# EasyEDA schematic SIMUL.json
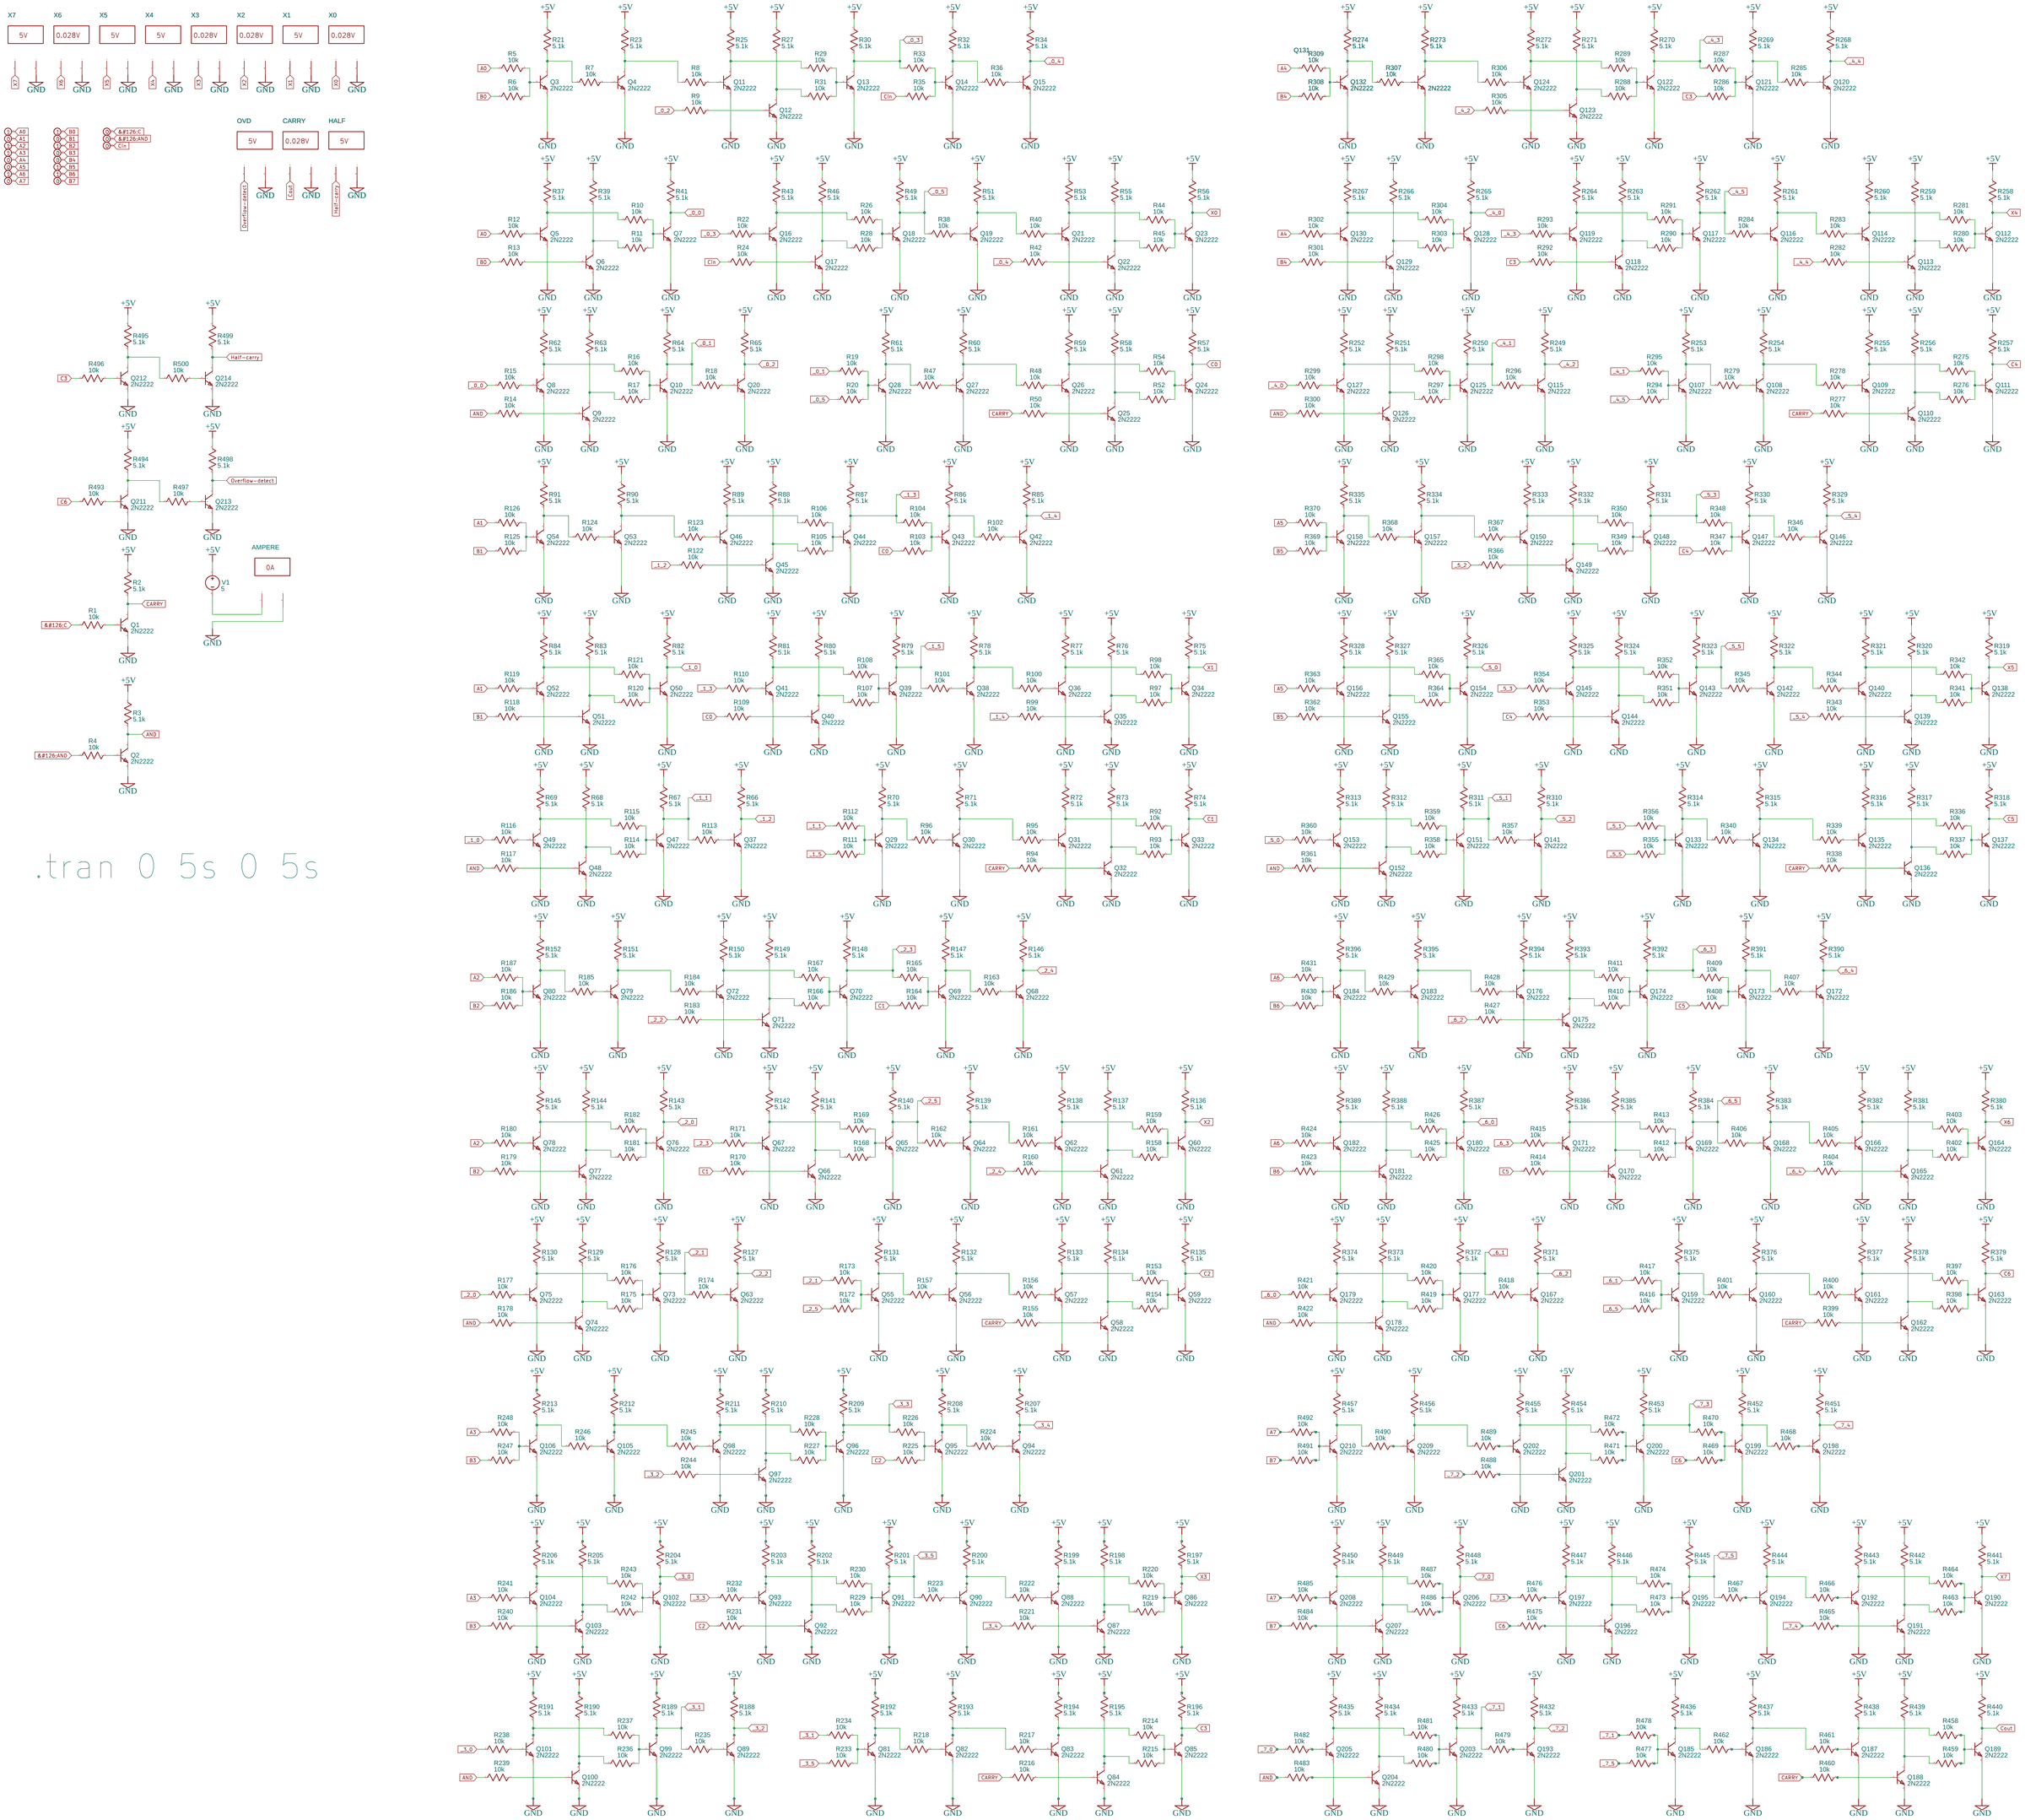
[diagram p0: schematic sheet]

## Parts
AMPERE  Multimeter
CARRY  Multimeter
HALF  Multimeter
OVD  Multimeter
Q1  2N2222
Q2  2N2222
Q3  2N2222
Q4  2N2222
Q5  2N2222
Q6  2N2222
Q7  2N2222
Q8  2N2222
Q9  2N2222
Q10  2N2222
Q11  2N2222
Q12  2N2222
Q13  2N2222
Q14  2N2222
Q15  2N2222
Q16  2N2222
Q17  2N2222
Q18  2N2222
Q19  2N2222
Q20  2N2222
Q21  2N2222
Q22  2N2222
Q23  2N2222
Q24  2N2222
Q25  2N2222
Q26  2N2222
Q27  2N2222
Q28  2N2222
Q29  2N2222
Q30  2N2222
Q31  2N2222
Q32  2N2222
Q33  2N2222
Q34  2N2222
Q35  2N2222
Q36  2N2222
Q37  2N2222
Q38  2N2222
Q39  2N2222
Q40  2N2222
Q41  2N2222
Q42  2N2222
Q43  2N2222
Q44  2N2222
Q45  2N2222
Q46  2N2222
Q47  2N2222
Q48  2N2222
Q49  2N2222
Q50  2N2222
Q51  2N2222
Q52  2N2222
Q53  2N2222
Q54  2N2222
Q55  2N2222
Q56  2N2222
Q57  2N2222
Q58  2N2222
Q59  2N2222
Q60  2N2222
Q61  2N2222
Q62  2N2222
Q63  2N2222
Q64  2N2222
Q65  2N2222
Q66  2N2222
Q67  2N2222
Q68  2N2222
Q69  2N2222
Q70  2N2222
Q71  2N2222
Q72  2N2222
Q73  2N2222
Q74  2N2222
Q75  2N2222
Q76  2N2222
Q77  2N2222
Q78  2N2222
Q79  2N2222
Q80  2N2222
Q81  2N2222
Q82  2N2222
Q83  2N2222
Q84  2N2222
Q85  2N2222
Q86  2N2222
Q87  2N2222
Q88  2N2222
Q89  2N2222
Q90  2N2222
Q91  2N2222
Q92  2N2222
Q93  2N2222
Q94  2N2222
Q95  2N2222
Q96  2N2222
Q97  2N2222
Q98  2N2222
Q99  2N2222
Q100  2N2222
Q101  2N2222
Q102  2N2222
Q103  2N2222
Q104  2N2222
Q105  2N2222
Q106  2N2222
Q107  2N2222
Q108  2N2222
Q109  2N2222
Q110  2N2222
Q111  2N2222
Q112  2N2222
Q113  2N2222
Q114  2N2222
Q115  2N2222
Q116  2N2222
Q117  2N2222
Q118  2N2222
Q119  2N2222
Q120  2N2222
Q121  2N2222
Q122  2N2222
Q123  2N2222
Q124  2N2222
Q125  2N2222
Q126  2N2222
Q127  2N2222
Q128  2N2222
Q129  2N2222
Q130  2N2222
Q131  2N2222
Q132  2N2222
Q133  2N2222
Q134  2N2222
Q135  2N2222
Q136  2N2222
Q137  2N2222
Q138  2N2222
Q139  2N2222
Q140  2N2222
Q141  2N2222
Q142  2N2222
Q143  2N2222
Q144  2N2222
Q145  2N2222
Q146  2N2222
Q147  2N2222
Q148  2N2222
Q149  2N2222
Q150  2N2222
Q151  2N2222
Q152  2N2222
Q153  2N2222
Q154  2N2222
Q155  2N2222
Q156  2N2222
Q157  2N2222
Q158  2N2222
Q159  2N2222
Q160  2N2222
Q161  2N2222
Q162  2N2222
Q163  2N2222
Q164  2N2222
Q165  2N2222
Q166  2N2222
Q167  2N2222
Q168  2N2222
Q169  2N2222
Q170  2N2222
Q171  2N2222
Q172  2N2222
Q173  2N2222
Q174  2N2222
Q175  2N2222
Q176  2N2222
Q177  2N2222
Q178  2N2222
Q179  2N2222
Q180  2N2222
Q181  2N2222
Q182  2N2222
Q183  2N2222
Q184  2N2222
Q185  2N2222
Q186  2N2222
Q187  2N2222
Q188  2N2222
Q189  2N2222
Q190  2N2222
Q191  2N2222
Q192  2N2222
Q193  2N2222
Q194  2N2222
Q195  2N2222
Q196  2N2222
Q197  2N2222
Q198  2N2222
Q199  2N2222
Q200  2N2222
Q201  2N2222
Q202  2N2222
Q203  2N2222
Q204  2N2222
Q205  2N2222
Q206  2N2222
Q207  2N2222
Q208  2N2222
Q209  2N2222
Q210  2N2222
Q211  2N2222
Q212  2N2222
Q213  2N2222
Q214  2N2222
R1  10k  [AXIAL-0.3]
R2  5.1k  [AXIAL-0.3]
R3  5.1k  [AXIAL-0.3]
R4  10k  [AXIAL-0.3]
R5  10k  [AXIAL-0.3]
R6  10k  [AXIAL-0.3]
R7  10k  [AXIAL-0.3]
R8  10k  [AXIAL-0.3]
R9  10k  [AXIAL-0.3]
R10  10k  [AXIAL-0.3]
R11  10k  [AXIAL-0.3]
R12  10k  [AXIAL-0.3]
R13  10k  [AXIAL-0.3]
R14  10k  [AXIAL-0.3]
R15  10k  [AXIAL-0.3]
R16  10k  [AXIAL-0.3]
R17  10k  [AXIAL-0.3]
R18  10k  [AXIAL-0.3]
R19  10k  [AXIAL-0.3]
R20  10k  [AXIAL-0.3]
R21  5.1k  [AXIAL-0.3]
R22  10k  [AXIAL-0.3]
R23  5.1k  [AXIAL-0.3]
R24  10k  [AXIAL-0.3]
R25  5.1k  [AXIAL-0.3]
R26  10k  [AXIAL-0.3]
R27  5.1k  [AXIAL-0.3]
R28  10k  [AXIAL-0.3]
R29  10k  [AXIAL-0.3]
R30  5.1k  [AXIAL-0.3]
R31  10k  [AXIAL-0.3]
R32  5.1k  [AXIAL-0.3]
R33  10k  [AXIAL-0.3]
R34  5.1k  [AXIAL-0.3]
R35  10k  [AXIAL-0.3]
R36  10k  [AXIAL-0.3]
R37  5.1k  [AXIAL-0.3]
R38  10k  [AXIAL-0.3]
R39  5.1k  [AXIAL-0.3]
R40  10k  [AXIAL-0.3]
R41  5.1k  [AXIAL-0.3]
R42  10k  [AXIAL-0.3]
R43  5.1k  [AXIAL-0.3]
R44  10k  [AXIAL-0.3]
R45  10k  [AXIAL-0.3]
R46  5.1k  [AXIAL-0.3]
R47  10k  [AXIAL-0.3]
R48  10k  [AXIAL-0.3]
R49  5.1k  [AXIAL-0.3]
R50  10k  [AXIAL-0.3]
R51  5.1k  [AXIAL-0.3]
R52  10k  [AXIAL-0.3]
R53  5.1k  [AXIAL-0.3]
R54  10k  [AXIAL-0.3]
R55  5.1k  [AXIAL-0.3]
R56  5.1k  [AXIAL-0.3]
R57  5.1k  [AXIAL-0.3]
R58  5.1k  [AXIAL-0.3]
R59  5.1k  [AXIAL-0.3]
R60  5.1k  [AXIAL-0.3]
R61  5.1k  [AXIAL-0.3]
R62  5.1k  [AXIAL-0.3]
R63  5.1k  [AXIAL-0.3]
R64  5.1k  [AXIAL-0.3]
R65  5.1k  [AXIAL-0.3]
R66  5.1k  [AXIAL-0.3]
R67  5.1k  [AXIAL-0.3]
R68  5.1k  [AXIAL-0.3]
R69  5.1k  [AXIAL-0.3]
R70  5.1k  [AXIAL-0.3]
R71  5.1k  [AXIAL-0.3]
R72  5.1k  [AXIAL-0.3]
R73  5.1k  [AXIAL-0.3]
R74  5.1k  [AXIAL-0.3]
R75  5.1k  [AXIAL-0.3]
R76  5.1k  [AXIAL-0.3]
R77  5.1k  [AXIAL-0.3]
R78  5.1k  [AXIAL-0.3]
R79  5.1k  [AXIAL-0.3]
R80  5.1k  [AXIAL-0.3]
R81  5.1k  [AXIAL-0.3]
R82  5.1k  [AXIAL-0.3]
R83  5.1k  [AXIAL-0.3]
R84  5.1k  [AXIAL-0.3]
R85  5.1k  [AXIAL-0.3]
R86  5.1k  [AXIAL-0.3]
R87  5.1k  [AXIAL-0.3]
R88  5.1k  [AXIAL-0.3]
R89  5.1k  [AXIAL-0.3]
R90  5.1k  [AXIAL-0.3]
R91  5.1k  [AXIAL-0.3]
R92  10k  [AXIAL-0.3]
R93  10k  [AXIAL-0.3]
R94  10k  [AXIAL-0.3]
R95  10k  [AXIAL-0.3]
R96  10k  [AXIAL-0.3]
R97  10k  [AXIAL-0.3]
R98  10k  [AXIAL-0.3]
R99  10k  [AXIAL-0.3]
R100  10k  [AXIAL-0.3]
R101  10k  [AXIAL-0.3]
R102  10k  [AXIAL-0.3]
R103  10k  [AXIAL-0.3]
R104  10k  [AXIAL-0.3]
R105  10k  [AXIAL-0.3]
R106  10k  [AXIAL-0.3]
R107  10k  [AXIAL-0.3]
R108  10k  [AXIAL-0.3]
R109  10k  [AXIAL-0.3]
R110  10k  [AXIAL-0.3]
R111  10k  [AXIAL-0.3]
R112  10k  [AXIAL-0.3]
R113  10k  [AXIAL-0.3]
R114  10k  [AXIAL-0.3]
R115  10k  [AXIAL-0.3]
R116  10k  [AXIAL-0.3]
R117  10k  [AXIAL-0.3]
R118  10k  [AXIAL-0.3]
R119  10k  [AXIAL-0.3]
R120  10k  [AXIAL-0.3]
R121  10k  [AXIAL-0.3]
R122  10k  [AXIAL-0.3]
R123  10k  [AXIAL-0.3]
R124  10k  [AXIAL-0.3]
R125  10k  [AXIAL-0.3]
R126  10k  [AXIAL-0.3]
R127  5.1k  [AXIAL-0.3]
R128  5.1k  [AXIAL-0.3]
R129  5.1k  [AXIAL-0.3]
R130  5.1k  [AXIAL-0.3]
R131  5.1k  [AXIAL-0.3]
R132  5.1k  [AXIAL-0.3]
R133  5.1k  [AXIAL-0.3]
R134  5.1k  [AXIAL-0.3]
R135  5.1k  [AXIAL-0.3]
R136  5.1k  [AXIAL-0.3]
R137  5.1k  [AXIAL-0.3]
R138  5.1k  [AXIAL-0.3]
R139  5.1k  [AXIAL-0.3]
R140  5.1k  [AXIAL-0.3]
R141  5.1k  [AXIAL-0.3]
R142  5.1k  [AXIAL-0.3]
R143  5.1k  [AXIAL-0.3]
R144  5.1k  [AXIAL-0.3]
R145  5.1k  [AXIAL-0.3]
R146  5.1k  [AXIAL-0.3]
R147  5.1k  [AXIAL-0.3]
R148  5.1k  [AXIAL-0.3]
R149  5.1k  [AXIAL-0.3]
R150  5.1k  [AXIAL-0.3]
R151  5.1k  [AXIAL-0.3]
R152  5.1k  [AXIAL-0.3]
R153  10k  [AXIAL-0.3]
R154  10k  [AXIAL-0.3]
R155  10k  [AXIAL-0.3]
R156  10k  [AXIAL-0.3]
R157  10k  [AXIAL-0.3]
R158  10k  [AXIAL-0.3]
R159  10k  [AXIAL-0.3]
R160  10k  [AXIAL-0.3]
R161  10k  [AXIAL-0.3]
R162  10k  [AXIAL-0.3]
R163  10k  [AXIAL-0.3]
R164  10k  [AXIAL-0.3]
R165  10k  [AXIAL-0.3]
R166  10k  [AXIAL-0.3]
R167  10k  [AXIAL-0.3]
R168  10k  [AXIAL-0.3]
R169  10k  [AXIAL-0.3]
R170  10k  [AXIAL-0.3]
R171  10k  [AXIAL-0.3]
R172  10k  [AXIAL-0.3]
R173  10k  [AXIAL-0.3]
R174  10k  [AXIAL-0.3]
R175  10k  [AXIAL-0.3]
R176  10k  [AXIAL-0.3]
R177  10k  [AXIAL-0.3]
R178  10k  [AXIAL-0.3]
R179  10k  [AXIAL-0.3]
R180  10k  [AXIAL-0.3]
R181  10k  [AXIAL-0.3]
R182  10k  [AXIAL-0.3]
R183  10k  [AXIAL-0.3]
R184  10k  [AXIAL-0.3]
R185  10k  [AXIAL-0.3]
R186  10k  [AXIAL-0.3]
R187  10k  [AXIAL-0.3]
R188  5.1k  [AXIAL-0.3]
R189  5.1k  [AXIAL-0.3]
R190  5.1k  [AXIAL-0.3]
R191  5.1k  [AXIAL-0.3]
R192  5.1k  [AXIAL-0.3]
R193  5.1k  [AXIAL-0.3]
R194  5.1k  [AXIAL-0.3]
R195  5.1k  [AXIAL-0.3]
R196  5.1k  [AXIAL-0.3]
R197  5.1k  [AXIAL-0.3]
R198  5.1k  [AXIAL-0.3]
R199  5.1k  [AXIAL-0.3]
R200  5.1k  [AXIAL-0.3]
R201  5.1k  [AXIAL-0.3]
R202  5.1k  [AXIAL-0.3]
R203  5.1k  [AXIAL-0.3]
R204  5.1k  [AXIAL-0.3]
R205  5.1k  [AXIAL-0.3]
R206  5.1k  [AXIAL-0.3]
R207  5.1k  [AXIAL-0.3]
R208  5.1k  [AXIAL-0.3]
R209  5.1k  [AXIAL-0.3]
R210  5.1k  [AXIAL-0.3]
R211  5.1k  [AXIAL-0.3]
R212  5.1k  [AXIAL-0.3]
R213  5.1k  [AXIAL-0.3]
R214  10k  [AXIAL-0.3]
R215  10k  [AXIAL-0.3]
R216  10k  [AXIAL-0.3]
R217  10k  [AXIAL-0.3]
R218  10k  [AXIAL-0.3]
R219  10k  [AXIAL-0.3]
R220  10k  [AXIAL-0.3]
R221  10k  [AXIAL-0.3]
R222  10k  [AXIAL-0.3]
R223  10k  [AXIAL-0.3]
R224  10k  [AXIAL-0.3]
R225  10k  [AXIAL-0.3]
R226  10k  [AXIAL-0.3]
R227  10k  [AXIAL-0.3]
R228  10k  [AXIAL-0.3]
R229  10k  [AXIAL-0.3]
R230  10k  [AXIAL-0.3]
R231  10k  [AXIAL-0.3]
R232  10k  [AXIAL-0.3]
R233  10k  [AXIAL-0.3]
R234  10k  [AXIAL-0.3]
R235  10k  [AXIAL-0.3]
R236  10k  [AXIAL-0.3]
R237  10k  [AXIAL-0.3]
R238  10k  [AXIAL-0.3]
R239  10k  [AXIAL-0.3]
R240  10k  [AXIAL-0.3]
R241  10k  [AXIAL-0.3]
R242  10k  [AXIAL-0.3]
R243  10k  [AXIAL-0.3]
R244  10k  [AXIAL-0.3]
R245  10k  [AXIAL-0.3]
R246  10k  [AXIAL-0.3]
R247  10k  [AXIAL-0.3]
R248  10k  [AXIAL-0.3]
R249  5.1k  [AXIAL-0.3]
R250  5.1k  [AXIAL-0.3]
R251  5.1k  [AXIAL-0.3]
R252  5.1k  [AXIAL-0.3]
R253  5.1k  [AXIAL-0.3]
R254  5.1k  [AXIAL-0.3]
R255  5.1k  [AXIAL-0.3]
R256  5.1k  [AXIAL-0.3]
R257  5.1k  [AXIAL-0.3]
R258  5.1k  [AXIAL-0.3]
R259  5.1k  [AXIAL-0.3]
R260  5.1k  [AXIAL-0.3]
R261  5.1k  [AXIAL-0.3]
R262  5.1k  [AXIAL-0.3]
R263  5.1k  [AXIAL-0.3]
R264  5.1k  [AXIAL-0.3]
R265  5.1k  [AXIAL-0.3]
R266  5.1k  [AXIAL-0.3]
R267  5.1k  [AXIAL-0.3]
R268  5.1k  [AXIAL-0.3]
R269  5.1k  [AXIAL-0.3]
R270  5.1k  [AXIAL-0.3]
R271  5.1k  [AXIAL-0.3]
R272  5.1k  [AXIAL-0.3]
R273  5.1k  [AXIAL-0.3]
R274  5.1k  [AXIAL-0.3]
R275  10k  [AXIAL-0.3]
R276  10k  [AXIAL-0.3]
R277  10k  [AXIAL-0.3]
R278  10k  [AXIAL-0.3]
R279  10k  [AXIAL-0.3]
R280  10k  [AXIAL-0.3]
R281  10k  [AXIAL-0.3]
R282  10k  [AXIAL-0.3]
R283  10k  [AXIAL-0.3]
R284  10k  [AXIAL-0.3]
R285  10k  [AXIAL-0.3]
R286  10k  [AXIAL-0.3]
R287  10k  [AXIAL-0.3]
R288  10k  [AXIAL-0.3]
R289  10k  [AXIAL-0.3]
R290  10k  [AXIAL-0.3]
R291  10k  [AXIAL-0.3]
R292  10k  [AXIAL-0.3]
R293  10k  [AXIAL-0.3]
R294  10k  [AXIAL-0.3]
R295  10k  [AXIAL-0.3]
R296  10k  [AXIAL-0.3]
R297  10k  [AXIAL-0.3]
R298  10k  [AXIAL-0.3]
R299  10k  [AXIAL-0.3]
R300  10k  [AXIAL-0.3]
R301  10k  [AXIAL-0.3]
R302  10k  [AXIAL-0.3]
R303  10k  [AXIAL-0.3]
R304  10k  [AXIAL-0.3]
R305  10k  [AXIAL-0.3]
R306  10k  [AXIAL-0.3]
R307  10k  [AXIAL-0.3]
R308  10k  [AXIAL-0.3]
R309  10k  [AXIAL-0.3]
R310  5.1k  [AXIAL-0.3]
R311  5.1k  [AXIAL-0.3]
R312  5.1k  [AXIAL-0.3]
R313  5.1k  [AXIAL-0.3]
R314  5.1k  [AXIAL-0.3]
R315  5.1k  [AXIAL-0.3]
R316  5.1k  [AXIAL-0.3]
R317  5.1k  [AXIAL-0.3]
R318  5.1k  [AXIAL-0.3]
R319  5.1k  [AXIAL-0.3]
R320  5.1k  [AXIAL-0.3]
R321  5.1k  [AXIAL-0.3]
R322  5.1k  [AXIAL-0.3]
R323  5.1k  [AXIAL-0.3]
R324  5.1k  [AXIAL-0.3]
R325  5.1k  [AXIAL-0.3]
R326  5.1k  [AXIAL-0.3]
R327  5.1k  [AXIAL-0.3]
R328  5.1k  [AXIAL-0.3]
R329  5.1k  [AXIAL-0.3]
R330  5.1k  [AXIAL-0.3]
R331  5.1k  [AXIAL-0.3]
R332  5.1k  [AXIAL-0.3]
R333  5.1k  [AXIAL-0.3]
R334  5.1k  [AXIAL-0.3]
R335  5.1k  [AXIAL-0.3]
R336  10k  [AXIAL-0.3]
R337  10k  [AXIAL-0.3]
R338  10k  [AXIAL-0.3]
R339  10k  [AXIAL-0.3]
R340  10k  [AXIAL-0.3]
R341  10k  [AXIAL-0.3]
R342  10k  [AXIAL-0.3]
R343  10k  [AXIAL-0.3]
R344  10k  [AXIAL-0.3]
R345  10k  [AXIAL-0.3]
R346  10k  [AXIAL-0.3]
R347  10k  [AXIAL-0.3]
R348  10k  [AXIAL-0.3]
R349  10k  [AXIAL-0.3]
R350  10k  [AXIAL-0.3]
R351  10k  [AXIAL-0.3]
R352  10k  [AXIAL-0.3]
R353  10k  [AXIAL-0.3]
R354  10k  [AXIAL-0.3]
R355  10k  [AXIAL-0.3]
R356  10k  [AXIAL-0.3]
R357  10k  [AXIAL-0.3]
R358  10k  [AXIAL-0.3]
R359  10k  [AXIAL-0.3]
R360  10k  [AXIAL-0.3]
R361  10k  [AXIAL-0.3]
R362  10k  [AXIAL-0.3]
R363  10k  [AXIAL-0.3]
R364  10k  [AXIAL-0.3]
R365  10k  [AXIAL-0.3]
R366  10k  [AXIAL-0.3]
R367  10k  [AXIAL-0.3]
R368  10k  [AXIAL-0.3]
R369  10k  [AXIAL-0.3]
R370  10k  [AXIAL-0.3]
R371  5.1k  [AXIAL-0.3]
R372  5.1k  [AXIAL-0.3]
R373  5.1k  [AXIAL-0.3]
R374  5.1k  [AXIAL-0.3]
R375  5.1k  [AXIAL-0.3]
R376  5.1k  [AXIAL-0.3]
R377  5.1k  [AXIAL-0.3]
R378  5.1k  [AXIAL-0.3]
R379  5.1k  [AXIAL-0.3]
R380  5.1k  [AXIAL-0.3]
R381  5.1k  [AXIAL-0.3]
R382  5.1k  [AXIAL-0.3]
R383  5.1k  [AXIAL-0.3]
R384  5.1k  [AXIAL-0.3]
R385  5.1k  [AXIAL-0.3]
R386  5.1k  [AXIAL-0.3]
R387  5.1k  [AXIAL-0.3]
R388  5.1k  [AXIAL-0.3]
R389  5.1k  [AXIAL-0.3]
R390  5.1k  [AXIAL-0.3]
R391  5.1k  [AXIAL-0.3]
R392  5.1k  [AXIAL-0.3]
R393  5.1k  [AXIAL-0.3]
R394  5.1k  [AXIAL-0.3]
R395  5.1k  [AXIAL-0.3]
R396  5.1k  [AXIAL-0.3]
R397  10k  [AXIAL-0.3]
R398  10k  [AXIAL-0.3]
R399  10k  [AXIAL-0.3]
R400  10k  [AXIAL-0.3]
R401  10k  [AXIAL-0.3]
R402  10k  [AXIAL-0.3]
R403  10k  [AXIAL-0.3]
R404  10k  [AXIAL-0.3]
R405  10k  [AXIAL-0.3]
R406  10k  [AXIAL-0.3]
R407  10k  [AXIAL-0.3]
R408  10k  [AXIAL-0.3]
R409  10k  [AXIAL-0.3]
R410  10k  [AXIAL-0.3]
R411  10k  [AXIAL-0.3]
R412  10k  [AXIAL-0.3]
R413  10k  [AXIAL-0.3]
R414  10k  [AXIAL-0.3]
R415  10k  [AXIAL-0.3]
R416  10k  [AXIAL-0.3]
R417  10k  [AXIAL-0.3]
R418  10k  [AXIAL-0.3]
R419  10k  [AXIAL-0.3]
R420  10k  [AXIAL-0.3]
R421  10k  [AXIAL-0.3]
R422  10k  [AXIAL-0.3]
R423  10k  [AXIAL-0.3]
R424  10k  [AXIAL-0.3]
R425  10k  [AXIAL-0.3]
R426  10k  [AXIAL-0.3]
R427  10k  [AXIAL-0.3]
R428  10k  [AXIAL-0.3]
R429  10k  [AXIAL-0.3]
R430  10k  [AXIAL-0.3]
R431  10k  [AXIAL-0.3]
R432  5.1k  [AXIAL-0.3]
R433  5.1k  [AXIAL-0.3]
R434  5.1k  [AXIAL-0.3]
R435  5.1k  [AXIAL-0.3]
R436  5.1k  [AXIAL-0.3]
R437  5.1k  [AXIAL-0.3]
R438  5.1k  [AXIAL-0.3]
R439  5.1k  [AXIAL-0.3]
R440  5.1k  [AXIAL-0.3]
R441  5.1k  [AXIAL-0.3]
R442  5.1k  [AXIAL-0.3]
R443  5.1k  [AXIAL-0.3]
R444  5.1k  [AXIAL-0.3]
R445  5.1k  [AXIAL-0.3]
R446  5.1k  [AXIAL-0.3]
R447  5.1k  [AXIAL-0.3]
R448  5.1k  [AXIAL-0.3]
R449  5.1k  [AXIAL-0.3]
R450  5.1k  [AXIAL-0.3]
R451  5.1k  [AXIAL-0.3]
R452  5.1k  [AXIAL-0.3]
R453  5.1k  [AXIAL-0.3]
R454  5.1k  [AXIAL-0.3]
R455  5.1k  [AXIAL-0.3]
R456  5.1k  [AXIAL-0.3]
R457  5.1k  [AXIAL-0.3]
R458  10k  [AXIAL-0.3]
R459  10k  [AXIAL-0.3]
R460  10k  [AXIAL-0.3]
R461  10k  [AXIAL-0.3]
R462  10k  [AXIAL-0.3]
R463  10k  [AXIAL-0.3]
R464  10k  [AXIAL-0.3]
R465  10k  [AXIAL-0.3]
R466  10k  [AXIAL-0.3]
R467  10k  [AXIAL-0.3]
R468  10k  [AXIAL-0.3]
R469  10k  [AXIAL-0.3]
R470  10k  [AXIAL-0.3]
R471  10k  [AXIAL-0.3]
R472  10k  [AXIAL-0.3]
R473  10k  [AXIAL-0.3]
R474  10k  [AXIAL-0.3]
R475  10k  [AXIAL-0.3]
R476  10k  [AXIAL-0.3]
R477  10k  [AXIAL-0.3]
R478  10k  [AXIAL-0.3]
R479  10k  [AXIAL-0.3]
R480  10k  [AXIAL-0.3]
R481  10k  [AXIAL-0.3]
R482  10k  [AXIAL-0.3]
R483  10k  [AXIAL-0.3]
R484  10k  [AXIAL-0.3]
R485  10k  [AXIAL-0.3]
R486  10k  [AXIAL-0.3]
R487  10k  [AXIAL-0.3]
R488  10k  [AXIAL-0.3]
R489  10k  [AXIAL-0.3]
R490  10k  [AXIAL-0.3]
R491  10k  [AXIAL-0.3]
R492  10k  [AXIAL-0.3]
R493  10k  [AXIAL-0.3]
R494  5.1k  [AXIAL-0.3]
R495  5.1k  [AXIAL-0.3]
R496  10k  [AXIAL-0.3]
R497  10k  [AXIAL-0.3]
R498  5.1k  [AXIAL-0.3]
R499  5.1k  [AXIAL-0.3]
R500  10k  [AXIAL-0.3]
U1  Logicstate
U2  Logicstate
U3  Logicstate
U4  Logicstate
U5  Logicstate
U6  Logicstate
U7  Logicstate
U8  Logicstate
U9  Logicstate
U10  Logicstate
U11  Logicstate
U12  Logicstate
U13  Logicstate
U14  Logicstate
U15  Logicstate
U16  Logicstate
U17  Logicstate
U18  Logicstate
U19  Logicstate
V1  5  [HDR1X2]
X0  Multimeter
X1  Multimeter
X2  Multimeter
X3  Multimeter
X4  Multimeter
X5  Multimeter
X6  Multimeter
X7  Multimeter

## Library data of the parts
AMPERE = MULTIMETER: Supplier: LCSC; Multimeter Type: Amper; Power Type: AC; Voltmeter resistance: 10μ; Ammeter resistance: 1G; NameDisplay: 0; Contributor: EasyEDA; sim: true
CARRY HALF OVD X0-X7 = MULTIMETER: Supplier: LCSC; Multimeter Type: Voltmeter; Power Type: AC; Voltmeter resistance: 10μ; Ammeter resistance: 1G; NameDisplay: 0; Contributor: EasyEDA; sim: true
Q1-Q214 = 2N2222: Contributor: EasyEDA
R1-R500 = Resistor_US: Resistance: 1k; Contributor: EasyEDA; Supplier: YUJING
U1 U3 U6 U7 U10 U13 U14 U16 = LOGICSTATE: catid: 20; Contributor: EasyEDA; NameDisplay: 0; 值: 0; PreDisplay: 0; State: high
U2 U4 U5 U8 U9 U11 U12 U15 U17-U19 = LOGICSTATE: catid: 20; Contributor: EasyEDA; NameDisplay: 0; 值: 0; PreDisplay: 0; State: low
V1 = VDC: Contributor: EasyEDA; sim: true

## Nets
+5V: R2.1 R3.1 R21.1 R23.1 R25.1 R27.1 R30.1 R32.1 R34.1 R37.1 R39.1 R41.1 R43.1 R46.1 R49.1 R51.1 R53.1 R55.1 R56.1 R57.1 R58.1 R59.1 R60.1 R61.1 R62.1 R63.1 R64.1 R65.1 R66.1 R67.1 R68.1 R69.1 R70.1 R71.1 R72.1 R73.1 R74.1 R75.1 R76.1 R77.1 R78.1 R79.1 R80.1 R81.1 R82.1 R83.1 R84.1 R85.1 R86.1 R87.1 R88.1 R89.1 R90.1 R91.1 R127.1 R128.1 R129.1 R130.1 R131.1 R132.1 R133.1 R134.1 R135.1 R136.1 R137.1 R138.1 R139.1 R140.1 R141.1 R142.1 R143.1 R144.1 R145.1 R146.1 R147.1 R148.1 R149.1 R150.1 R151.1 R152.1 R188.1 R189.1 R190.1 R191.1 R192.1 R193.1 R194.1 R195.1 R196.1 R197.1 R198.1 R199.1 R200.1 R201.1 R202.1 R203.1 R204.1 R205.1 R206.1 R207.1 R208.1 R209.1 R210.1 R211.1 R212.1 R213.1 R249.1 R250.1 R251.1 R252.1 R253.1 R254.1 R255.1 R256.1 R257.1 R258.1 R259.1 R260.1 R261.1 R262.1 R263.1 R264.1 R265.1 R266.1 R267.1 R268.1 R269.1 R270.1 R271.1 R272.1 R273.1 R274.1 R310.1 R311.1 R312.1 R313.1 R314.1 R315.1 R316.1 R317.1 R318.1 R319.1 R320.1 R321.1 R322.1 R323.1 R324.1 R325.1 R326.1 R327.1 R328.1 R329.1 R330.1 R331.1 R332.1 R333.1 R334.1 R335.1 R371.1 R372.1 R373.1 R374.1 R375.1 R376.1 R377.1 R378.1 R379.1 R380.1 R381.1 R382.1 R383.1 R384.1 R385.1 R386.1 R387.1 R388.1 R389.1 R390.1 R391.1 R392.1 R393.1 R394.1 R395.1 R396.1 R432.1 R433.1 R434.1 R435.1 R436.1 R437.1 R438.1 R439.1 R440.1 R441.1 R442.1 R443.1 R444.1 R445.1 R446.1 R447.1 R448.1 R449.1 R450.1 R451.1 R452.1 R453.1 R454.1 R455.1 R456.1 R457.1 R494.1 R495.1 R498.1 R499.1 V1.1
GND: AMPERE.2(I) CARRY.2(I) HALF.2(I) OVD.2(I) Q1.2(E) Q2.2(E) Q3.2(E) Q4.2(E) Q5.2(E) Q6.2(E) Q7.2(E) Q8.2(E) Q9.2(E) Q10.2(E) Q11.2(E) Q12.2(E) Q13.2(E) Q14.2(E) Q15.2(E) Q16.2(E) Q17.2(E) Q18.2(E) Q19.2(E) Q20.2(E) Q21.2(E) Q22.2(E) Q23.2(E) Q24.2(E) Q25.2(E) Q26.2(E) Q27.2(E) Q28.2(E) Q29.2(E) Q30.2(E) Q31.2(E) Q32.2(E) Q33.2(E) Q34.2(E) Q35.2(E) Q36.2(E) Q37.2(E) Q38.2(E) Q39.2(E) Q40.2(E) Q41.2(E) Q42.2(E) Q43.2(E) Q44.2(E) Q45.2(E) Q46.2(E) Q47.2(E) Q48.2(E) Q49.2(E) Q50.2(E) Q51.2(E) Q52.2(E) Q53.2(E) Q54.2(E) Q55.2(E) Q56.2(E) Q57.2(E) Q58.2(E) Q59.2(E) Q60.2(E) Q61.2(E) Q62.2(E) Q63.2(E) Q64.2(E) Q65.2(E) Q66.2(E) Q67.2(E) Q68.2(E) Q69.2(E) Q70.2(E) Q71.2(E) Q72.2(E) Q73.2(E) Q74.2(E) Q75.2(E) Q76.2(E) Q77.2(E) Q78.2(E) Q79.2(E) Q80.2(E) Q81.2(E) Q82.2(E) Q83.2(E) Q84.2(E) Q85.2(E) Q86.2(E) Q87.2(E) Q88.2(E) Q89.2(E) Q90.2(E) Q91.2(E) Q92.2(E) Q93.2(E) Q94.2(E) Q95.2(E) Q96.2(E) Q97.2(E) Q98.2(E) Q99.2(E) Q100.2(E) Q101.2(E) Q102.2(E) Q103.2(E) Q104.2(E) Q105.2(E) Q106.2(E) Q107.2(E) Q108.2(E) Q109.2(E) Q110.2(E) Q111.2(E) Q112.2(E) Q113.2(E) Q114.2(E) Q115.2(E) Q116.2(E) Q117.2(E) Q118.2(E) Q119.2(E) Q120.2(E) Q121.2(E) Q122.2(E) Q123.2(E) Q124.2(E) Q125.2(E) Q126.2(E) Q127.2(E) Q128.2(E) Q129.2(E) Q130.2(E) Q131.2(E) Q132.2(E) Q133.2(E) Q134.2(E) Q135.2(E) Q136.2(E) Q137.2(E) Q138.2(E) Q139.2(E) Q140.2(E) Q141.2(E) Q142.2(E) Q143.2(E) Q144.2(E) Q145.2(E) Q146.2(E) Q147.2(E) Q148.2(E) Q149.2(E) Q150.2(E) Q151.2(E) Q152.2(E) Q153.2(E) Q154.2(E) Q155.2(E) Q156.2(E) Q157.2(E) Q158.2(E) Q159.2(E) Q160.2(E) Q161.2(E) Q162.2(E) Q163.2(E) Q164.2(E) Q165.2(E) Q166.2(E) Q167.2(E) Q168.2(E) Q169.2(E) Q170.2(E) Q171.2(E) Q172.2(E) Q173.2(E) Q174.2(E) Q175.2(E) Q176.2(E) Q177.2(E) Q178.2(E) Q179.2(E) Q180.2(E) Q181.2(E) Q182.2(E) Q183.2(E) Q184.2(E) Q185.2(E) Q186.2(E) Q187.2(E) Q188.2(E) Q189.2(E) Q190.2(E) Q191.2(E) Q192.2(E) Q193.2(E) Q194.2(E) Q195.2(E) Q196.2(E) Q197.2(E) Q198.2(E) Q199.2(E) Q200.2(E) Q201.2(E) Q202.2(E) Q203.2(E) Q204.2(E) Q205.2(E) Q206.2(E) Q207.2(E) Q208.2(E) Q209.2(E) Q210.2(E) Q211.2(E) Q212.2(E) Q213.2(E) Q214.2(E) X0.2(I) X1.2(I) X2.2(I) X3.2(I) X4.2(I) X5.2(I) X6.2(I) X7.2(I)
&#126;AND: R4.1 U18.1
&#126;C: R1.1 U17.1
_0_0: Q7.3(C) R15.1 R41.2
_0_1: Q10.3(C) R18.1 R19.1 R64.2
_0_2: Q20.3(C) R9.1 R65.2
_0_3: Q13.3(C) R22.1 R30.2 R33.1
_0_4: Q15.3(C) R34.2 R42.1
_0_5: Q18.3(C) R20.1 R38.1 R49.2
_1_0: Q50.3(C) R82.2 R116.1
_1_1: Q47.3(C) R67.2 R112.1 R113.1
_1_2: Q37.3(C) R66.2 R122.1
_1_3: Q44.3(C) R87.2 R104.1 R110.1
_1_4: Q42.3(C) R85.2 R99.1
_1_5: Q39.3(C) R79.2 R101.1 R111.1
_2_0: Q76.3(C) R143.2 R177.1
_2_1: Q73.3(C) R128.2 R173.1 R174.1
_2_2: Q63.3(C) R127.2 R183.1
_2_3: Q70.3(C) R148.2 R165.1 R171.1
_2_4: Q68.3(C) R146.2 R160.1
_2_5: Q65.3(C) R140.2 R162.1 R172.1
_3_0: Q102.3(C) R204.2 R238.1
_3_1: Q99.3(C) R189.2 R234.1 R235.1
_3_2: Q89.3(C) R188.2 R244.1
_3_3: Q96.3(C) R209.2 R226.1 R232.1
_3_4: Q94.3(C) R207.2 R221.1
_3_5: Q91.3(C) R201.2 R223.1 R233.1
_4_0: Q128.3(C) R265.2 R299.1
_4_1: Q125.3(C) R250.2 R295.1 R296.1
_4_2: Q115.3(C) R249.2 R305.1
_4_3: Q122.3(C) R270.2 R287.1 R293.1
_4_4: Q120.3(C) R268.2 R282.1
_4_5: Q117.3(C) R262.2 R284.1 R294.1
_5_0: Q154.3(C) R326.2 R360.1
_5_1: Q151.3(C) R311.2 R356.1 R357.1
_5_2: Q141.3(C) R310.2 R366.1
_5_3: Q148.3(C) R331.2 R348.1 R354.1
_5_4: Q146.3(C) R329.2 R343.1
_5_5: Q143.3(C) R323.2 R345.1 R355.1
_6_0: Q180.3(C) R387.2 R421.1
_6_1: Q177.3(C) R372.2 R417.1 R418.1
_6_2: Q167.3(C) R371.2 R427.1
_6_3: Q174.3(C) R392.2 R409.1 R415.1
_6_4: Q172.3(C) R390.2 R404.1
_6_5: Q169.3(C) R384.2 R406.1 R416.1
_7_0: Q206.3(C) R448.2 R482.1
_7_1: Q203.3(C) R433.2 R478.1 R479.1
_7_2: Q193.3(C) R432.2 R488.1
_7_3: Q200.3(C) R453.2 R470.1 R476.1
_7_4: Q198.3(C) R451.2 R465.1
_7_5: Q195.3(C) R445.2 R467.1 R477.1
A0: R5.1 R12.1 U1.1
A1: R119.1 R126.1 U2.1
A2: R180.1 R187.1 U3.1
A3: R241.1 R248.1 U6.1
A4: R302.1 R309.1 U5.1
A5: R363.1 R370.1 U4.1
A6: R424.1 R431.1 U7.1
A7: R485.1 R492.1 U8.1
AND: Q2.3(C) R3.2 R14.1 R117.1 R178.1 R239.1 R300.1 R361.1 R422.1 R483.1
B0: R6.1 R13.1 U16.1
B1: R118.1 R125.1 U15.1
B2: R179.1 R186.1 U14.1
B3: R240.1 R247.1 U11.1
B4: R301.1 R308.1 U12.1
B5: R362.1 R369.1 U13.1
B6: R423.1 R430.1 U10.1
B7: R484.1 R491.1 U9.1
C0: Q24.3(C) R57.2 R103.1 R109.1
C1: Q33.3(C) R74.2 R164.1 R170.1
C2: Q59.3(C) R135.2 R225.1 R231.1
C3: Q85.3(C) R196.2 R286.1 R292.1 R496.1
C4: Q111.3(C) R257.2 R347.1 R353.1
C5: Q137.3(C) R318.2 R408.1 R414.1
C6: Q163.3(C) R379.2 R469.1 R475.1 R493.1
CARRY: Q1.3(C) R2.2 R50.1 R94.1 R155.1 R216.1 R277.1 R338.1 R399.1 R460.1
Cin: R24.1 R35.1 U19.1
Cout: CARRY.1(+) Q189.3(C) R440.2
Half-carry: HALF.1(+) Q214.3(C) R499.2
Overflow-detect: OVD.1(+) Q213.3(C) R498.2
X0: Q23.3(C) R56.2 X0.1(+)
X1: Q34.3(C) R75.2 X1.1(+)
X2: Q60.3(C) R136.2 X2.1(+)
X3: Q86.3(C) R197.2 X3.1(+)
X4: Q112.3(C) R258.2 X4.1(+)
X5: Q138.3(C) R319.2 X5.1(+)
X6: Q164.3(C) R380.2 X6.1(+)
X7: Q190.3(C) R441.2 X7.1(+)
Net-(AMPERE-1): AMPERE.1(+) V1.2
Net-(Q1-1): Q1.1(B) R1.2
Net-(Q2-1): Q2.1(B) R4.2
Net-(Q3-1): Q3.1(B) R5.2 R6.2
Net-(Q3-3): Q3.3(C) R7.1 R21.2
Net-(Q4-1): Q4.1(B) R7.2
Net-(Q4-3): Q4.3(C) R8.1 R23.2
Net-(Q5-1): Q5.1(B) R12.2
Net-(Q5-3): Q5.3(C) R10.1 R37.2
Net-(Q6-1): Q6.1(B) R13.2
Net-(Q6-3): Q6.3(C) R11.1 R39.2
Net-(Q7-1): Q7.1(B) R10.2 R11.2
Net-(Q8-1): Q8.1(B) R15.2
Net-(Q8-3): Q8.3(C) R16.1 R62.2
Net-(Q9-1): Q9.1(B) R14.2
Net-(Q9-3): Q9.3(C) R17.1 R63.2
Net-(Q10-1): Q10.1(B) R16.2 R17.2
Net-(Q11-1): Q11.1(B) R8.2
Net-(Q11-3): Q11.3(C) R25.2 R29.1
Net-(Q12-1): Q12.1(B) R9.2
Net-(Q12-3): Q12.3(C) R27.2 R31.1
Net-(Q13-1): Q13.1(B) R29.2 R31.2
Net-(Q14-1): Q14.1(B) R33.2 R35.2
Net-(Q14-3): Q14.3(C) R32.2 R36.1
Net-(Q15-1): Q15.1(B) R36.2
Net-(Q16-1): Q16.1(B) R22.2
Net-(Q16-3): Q16.3(C) R26.1 R43.2
Net-(Q17-1): Q17.1(B) R24.2
Net-(Q17-3): Q17.3(C) R28.1 R46.2
Net-(Q18-1): Q18.1(B) R26.2 R28.2
Net-(Q19-1): Q19.1(B) R38.2
Net-(Q19-3): Q19.3(C) R40.1 R51.2
Net-(Q20-1): Q20.1(B) R18.2
Net-(Q21-1): Q21.1(B) R40.2
Net-(Q21-3): Q21.3(C) R44.1 R53.2
Net-(Q22-1): Q22.1(B) R42.2
Net-(Q22-3): Q22.3(C) R45.1 R55.2
Net-(Q23-1): Q23.1(B) R44.2 R45.2
Net-(Q24-1): Q24.1(B) R52.2 R54.2
Net-(Q25-1): Q25.1(B) R50.2
Net-(Q25-3): Q25.3(C) R52.1 R58.2
Net-(Q26-1): Q26.1(B) R48.2
Net-(Q26-3): Q26.3(C) R54.1 R59.2
Net-(Q27-1): Q27.1(B) R47.2
Net-(Q27-3): Q27.3(C) R48.1 R60.2
Net-(Q28-1): Q28.1(B) R19.2 R20.2
Net-(Q28-3): Q28.3(C) R47.1 R61.2
Net-(Q29-1): Q29.1(B) R111.2 R112.2
Net-(Q29-3): Q29.3(C) R70.2 R96.1
Net-(Q30-1): Q30.1(B) R96.2
Net-(Q30-3): Q30.3(C) R71.2 R95.1
Net-(Q31-1): Q31.1(B) R95.2
Net-(Q31-3): Q31.3(C) R72.2 R92.1
Net-(Q32-1): Q32.1(B) R94.2
Net-(Q32-3): Q32.3(C) R73.2 R93.1
Net-(Q33-1): Q33.1(B) R92.2 R93.2
Net-(Q34-1): Q34.1(B) R97.2 R98.2
Net-(Q35-1): Q35.1(B) R99.2
Net-(Q35-3): Q35.3(C) R76.2 R97.1
Net-(Q36-1): Q36.1(B) R100.2
Net-(Q36-3): Q36.3(C) R77.2 R98.1
Net-(Q37-1): Q37.1(B) R113.2
Net-(Q38-1): Q38.1(B) R101.2
Net-(Q38-3): Q38.3(C) R78.2 R100.1
Net-(Q39-1): Q39.1(B) R107.2 R108.2
Net-(Q40-1): Q40.1(B) R109.2
Net-(Q40-3): Q40.3(C) R80.2 R107.1
Net-(Q41-1): Q41.1(B) R110.2
Net-(Q41-3): Q41.3(C) R81.2 R108.1
Net-(Q42-1): Q42.1(B) R102.2
Net-(Q43-1): Q43.1(B) R103.2 R104.2
Net-(Q43-3): Q43.3(C) R86.2 R102.1
Net-(Q44-1): Q44.1(B) R105.2 R106.2
Net-(Q45-1): Q45.1(B) R122.2
Net-(Q45-3): Q45.3(C) R88.2 R105.1
Net-(Q46-1): Q46.1(B) R123.2
Net-(Q46-3): Q46.3(C) R89.2 R106.1
Net-(Q47-1): Q47.1(B) R114.2 R115.2
Net-(Q48-1): Q48.1(B) R117.2
Net-(Q48-3): Q48.3(C) R68.2 R114.1
Net-(Q49-1): Q49.1(B) R116.2
Net-(Q49-3): Q49.3(C) R69.2 R115.1
Net-(Q50-1): Q50.1(B) R120.2 R121.2
Net-(Q51-1): Q51.1(B) R118.2
Net-(Q51-3): Q51.3(C) R83.2 R120.1
Net-(Q52-1): Q52.1(B) R119.2
Net-(Q52-3): Q52.3(C) R84.2 R121.1
Net-(Q53-1): Q53.1(B) R124.2
Net-(Q53-3): Q53.3(C) R90.2 R123.1
Net-(Q54-1): Q54.1(B) R125.2 R126.2
Net-(Q54-3): Q54.3(C) R91.2 R124.1
Net-(Q55-1): Q55.1(B) R172.2 R173.2
Net-(Q55-3): Q55.3(C) R131.2 R157.1
Net-(Q56-1): Q56.1(B) R157.2
Net-(Q56-3): Q56.3(C) R132.2 R156.1
Net-(Q57-1): Q57.1(B) R156.2
Net-(Q57-3): Q57.3(C) R133.2 R153.1
Net-(Q58-1): Q58.1(B) R155.2
Net-(Q58-3): Q58.3(C) R134.2 R154.1
Net-(Q59-1): Q59.1(B) R153.2 R154.2
Net-(Q60-1): Q60.1(B) R158.2 R159.2
Net-(Q61-1): Q61.1(B) R160.2
Net-(Q61-3): Q61.3(C) R137.2 R158.1
Net-(Q62-1): Q62.1(B) R161.2
Net-(Q62-3): Q62.3(C) R138.2 R159.1
Net-(Q63-1): Q63.1(B) R174.2
Net-(Q64-1): Q64.1(B) R162.2
Net-(Q64-3): Q64.3(C) R139.2 R161.1
Net-(Q65-1): Q65.1(B) R168.2 R169.2
Net-(Q66-1): Q66.1(B) R170.2
Net-(Q66-3): Q66.3(C) R141.2 R168.1
Net-(Q67-1): Q67.1(B) R171.2
Net-(Q67-3): Q67.3(C) R142.2 R169.1
Net-(Q68-1): Q68.1(B) R163.2
Net-(Q69-1): Q69.1(B) R164.2 R165.2
Net-(Q69-3): Q69.3(C) R147.2 R163.1
Net-(Q70-1): Q70.1(B) R166.2 R167.2
Net-(Q71-1): Q71.1(B) R183.2
Net-(Q71-3): Q71.3(C) R149.2 R166.1
Net-(Q72-1): Q72.1(B) R184.2
Net-(Q72-3): Q72.3(C) R150.2 R167.1
Net-(Q73-1): Q73.1(B) R175.2 R176.2
Net-(Q74-1): Q74.1(B) R178.2
Net-(Q74-3): Q74.3(C) R129.2 R175.1
Net-(Q75-1): Q75.1(B) R177.2
Net-(Q75-3): Q75.3(C) R130.2 R176.1
Net-(Q76-1): Q76.1(B) R181.2 R182.2
Net-(Q77-1): Q77.1(B) R179.2
Net-(Q77-3): Q77.3(C) R144.2 R181.1
Net-(Q78-1): Q78.1(B) R180.2
Net-(Q78-3): Q78.3(C) R145.2 R182.1
Net-(Q79-1): Q79.1(B) R185.2
Net-(Q79-3): Q79.3(C) R151.2 R184.1
Net-(Q80-1): Q80.1(B) R186.2 R187.2
Net-(Q80-3): Q80.3(C) R152.2 R185.1
Net-(Q81-1): Q81.1(B) R233.2 R234.2
Net-(Q81-3): Q81.3(C) R192.2 R218.1
Net-(Q82-1): Q82.1(B) R218.2
Net-(Q82-3): Q82.3(C) R193.2 R217.1
Net-(Q83-1): Q83.1(B) R217.2
Net-(Q83-3): Q83.3(C) R194.2 R214.1
Net-(Q84-1): Q84.1(B) R216.2
Net-(Q84-3): Q84.3(C) R195.2 R215.1
Net-(Q85-1): Q85.1(B) R214.2 R215.2
Net-(Q86-1): Q86.1(B) R219.2 R220.2
Net-(Q87-1): Q87.1(B) R221.2
Net-(Q87-3): Q87.3(C) R198.2 R219.1
Net-(Q88-1): Q88.1(B) R222.2
Net-(Q88-3): Q88.3(C) R199.2 R220.1
Net-(Q89-1): Q89.1(B) R235.2
Net-(Q90-1): Q90.1(B) R223.2
Net-(Q90-3): Q90.3(C) R200.2 R222.1
Net-(Q91-1): Q91.1(B) R229.2 R230.2
Net-(Q92-1): Q92.1(B) R231.2
Net-(Q92-3): Q92.3(C) R202.2 R229.1
Net-(Q93-1): Q93.1(B) R232.2
Net-(Q93-3): Q93.3(C) R203.2 R230.1
Net-(Q94-1): Q94.1(B) R224.2
Net-(Q95-1): Q95.1(B) R225.2 R226.2
Net-(Q95-3): Q95.3(C) R208.2 R224.1
Net-(Q96-1): Q96.1(B) R227.2 R228.2
Net-(Q97-1): Q97.1(B) R244.2
Net-(Q97-3): Q97.3(C) R210.2 R227.1
Net-(Q98-1): Q98.1(B) R245.2
Net-(Q98-3): Q98.3(C) R211.2 R228.1
Net-(Q99-1): Q99.1(B) R236.2 R237.2
Net-(Q100-1): Q100.1(B) R239.2
Net-(Q100-3): Q100.3(C) R190.2 R236.1
Net-(Q101-1): Q101.1(B) R238.2
Net-(Q101-3): Q101.3(C) R191.2 R237.1
Net-(Q102-1): Q102.1(B) R242.2 R243.2
Net-(Q103-1): Q103.1(B) R240.2
Net-(Q103-3): Q103.3(C) R205.2 R242.1
Net-(Q104-1): Q104.1(B) R241.2
Net-(Q104-3): Q104.3(C) R206.2 R243.1
Net-(Q105-1): Q105.1(B) R246.2
Net-(Q105-3): Q105.3(C) R212.2 R245.1
Net-(Q106-1): Q106.1(B) R247.2 R248.2
Net-(Q106-3): Q106.3(C) R213.2 R246.1
Net-(Q107-1): Q107.1(B) R294.2 R295.2
Net-(Q107-3): Q107.3(C) R253.2 R279.1
Net-(Q108-1): Q108.1(B) R279.2
Net-(Q108-3): Q108.3(C) R254.2 R278.1
Net-(Q109-1): Q109.1(B) R278.2
Net-(Q109-3): Q109.3(C) R255.2 R275.1
Net-(Q110-1): Q110.1(B) R277.2
Net-(Q110-3): Q110.3(C) R256.2 R276.1
Net-(Q111-1): Q111.1(B) R275.2 R276.2
Net-(Q112-1): Q112.1(B) R280.2 R281.2
Net-(Q113-1): Q113.1(B) R282.2
Net-(Q113-3): Q113.3(C) R259.2 R280.1
Net-(Q114-1): Q114.1(B) R283.2
Net-(Q114-3): Q114.3(C) R260.2 R281.1
Net-(Q115-1): Q115.1(B) R296.2
Net-(Q116-1): Q116.1(B) R284.2
Net-(Q116-3): Q116.3(C) R261.2 R283.1
Net-(Q117-1): Q117.1(B) R290.2 R291.2
Net-(Q118-1): Q118.1(B) R292.2
Net-(Q118-3): Q118.3(C) R263.2 R290.1
Net-(Q119-1): Q119.1(B) R293.2
Net-(Q119-3): Q119.3(C) R264.2 R291.1
Net-(Q120-1): Q120.1(B) R285.2
Net-(Q121-1): Q121.1(B) R286.2 R287.2
Net-(Q121-3): Q121.3(C) R269.2 R285.1
Net-(Q122-1): Q122.1(B) R288.2 R289.2
Net-(Q123-1): Q123.1(B) R305.2
Net-(Q123-3): Q123.3(C) R271.2 R288.1
Net-(Q124-1): Q124.1(B) R306.2
Net-(Q124-3): Q124.3(C) R272.2 R289.1
Net-(Q125-1): Q125.1(B) R297.2 R298.2
Net-(Q126-1): Q126.1(B) R300.2
Net-(Q126-3): Q126.3(C) R251.2 R297.1
Net-(Q127-1): Q127.1(B) R299.2
Net-(Q127-3): Q127.3(C) R252.2 R298.1
Net-(Q128-1): Q128.1(B) R303.2 R304.2
Net-(Q129-1): Q129.1(B) R301.2
Net-(Q129-3): Q129.3(C) R266.2 R303.1
Net-(Q130-1): Q130.1(B) R302.2
Net-(Q130-3): Q130.3(C) R267.2 R304.1
Net-(Q131-1): Q131.1(B) R307.2
Net-(Q131-3): Q131.3(C) R273.2 R306.1
Net-(Q132-1): Q132.1(B) R308.2 R309.2
Net-(Q132-3): Q132.3(C) R274.2 R307.1
Net-(Q133-1): Q133.1(B) R355.2 R356.2
Net-(Q133-3): Q133.3(C) R314.2 R340.1
Net-(Q134-1): Q134.1(B) R340.2
Net-(Q134-3): Q134.3(C) R315.2 R339.1
Net-(Q135-1): Q135.1(B) R339.2
Net-(Q135-3): Q135.3(C) R316.2 R336.1
Net-(Q136-1): Q136.1(B) R338.2
Net-(Q136-3): Q136.3(C) R317.2 R337.1
Net-(Q137-1): Q137.1(B) R336.2 R337.2
Net-(Q138-1): Q138.1(B) R341.2 R342.2
Net-(Q139-1): Q139.1(B) R343.2
Net-(Q139-3): Q139.3(C) R320.2 R341.1
Net-(Q140-1): Q140.1(B) R344.2
Net-(Q140-3): Q140.3(C) R321.2 R342.1
Net-(Q141-1): Q141.1(B) R357.2
Net-(Q142-1): Q142.1(B) R345.2
Net-(Q142-3): Q142.3(C) R322.2 R344.1
Net-(Q143-1): Q143.1(B) R351.2 R352.2
Net-(Q144-1): Q144.1(B) R353.2
Net-(Q144-3): Q144.3(C) R324.2 R351.1
Net-(Q145-1): Q145.1(B) R354.2
Net-(Q145-3): Q145.3(C) R325.2 R352.1
Net-(Q146-1): Q146.1(B) R346.2
Net-(Q147-1): Q147.1(B) R347.2 R348.2
Net-(Q147-3): Q147.3(C) R330.2 R346.1
Net-(Q148-1): Q148.1(B) R349.2 R350.2
Net-(Q149-1): Q149.1(B) R366.2
Net-(Q149-3): Q149.3(C) R332.2 R349.1
Net-(Q150-1): Q150.1(B) R367.2
Net-(Q150-3): Q150.3(C) R333.2 R350.1
Net-(Q151-1): Q151.1(B) R358.2 R359.2
Net-(Q152-1): Q152.1(B) R361.2
Net-(Q152-3): Q152.3(C) R312.2 R358.1
Net-(Q153-1): Q153.1(B) R360.2
Net-(Q153-3): Q153.3(C) R313.2 R359.1
Net-(Q154-1): Q154.1(B) R364.2 R365.2
Net-(Q155-1): Q155.1(B) R362.2
Net-(Q155-3): Q155.3(C) R327.2 R364.1
Net-(Q156-1): Q156.1(B) R363.2
Net-(Q156-3): Q156.3(C) R328.2 R365.1
Net-(Q157-1): Q157.1(B) R368.2
Net-(Q157-3): Q157.3(C) R334.2 R367.1
Net-(Q158-1): Q158.1(B) R369.2 R370.2
Net-(Q158-3): Q158.3(C) R335.2 R368.1
Net-(Q159-1): Q159.1(B) R416.2 R417.2
Net-(Q159-3): Q159.3(C) R375.2 R401.1
Net-(Q160-1): Q160.1(B) R401.2
Net-(Q160-3): Q160.3(C) R376.2 R400.1
Net-(Q161-1): Q161.1(B) R400.2
Net-(Q161-3): Q161.3(C) R377.2 R397.1
Net-(Q162-1): Q162.1(B) R399.2
Net-(Q162-3): Q162.3(C) R378.2 R398.1
Net-(Q163-1): Q163.1(B) R397.2 R398.2
Net-(Q164-1): Q164.1(B) R402.2 R403.2
Net-(Q165-1): Q165.1(B) R404.2
Net-(Q165-3): Q165.3(C) R381.2 R402.1
Net-(Q166-1): Q166.1(B) R405.2
Net-(Q166-3): Q166.3(C) R382.2 R403.1
Net-(Q167-1): Q167.1(B) R418.2
Net-(Q168-1): Q168.1(B) R406.2
Net-(Q168-3): Q168.3(C) R383.2 R405.1
Net-(Q169-1): Q169.1(B) R412.2 R413.2
Net-(Q170-1): Q170.1(B) R414.2
Net-(Q170-3): Q170.3(C) R385.2 R412.1
Net-(Q171-1): Q171.1(B) R415.2
Net-(Q171-3): Q171.3(C) R386.2 R413.1
Net-(Q172-1): Q172.1(B) R407.2
Net-(Q173-1): Q173.1(B) R408.2 R409.2
Net-(Q173-3): Q173.3(C) R391.2 R407.1
Net-(Q174-1): Q174.1(B) R410.2 R411.2
Net-(Q175-1): Q175.1(B) R427.2
Net-(Q175-3): Q175.3(C) R393.2 R410.1
Net-(Q176-1): Q176.1(B) R428.2
Net-(Q176-3): Q176.3(C) R394.2 R411.1
Net-(Q177-1): Q177.1(B) R419.2 R420.2
Net-(Q178-1): Q178.1(B) R422.2
Net-(Q178-3): Q178.3(C) R373.2 R419.1
Net-(Q179-1): Q179.1(B) R421.2
Net-(Q179-3): Q179.3(C) R374.2 R420.1
Net-(Q180-1): Q180.1(B) R425.2 R426.2
Net-(Q181-1): Q181.1(B) R423.2
Net-(Q181-3): Q181.3(C) R388.2 R425.1
Net-(Q182-1): Q182.1(B) R424.2
Net-(Q182-3): Q182.3(C) R389.2 R426.1
Net-(Q183-1): Q183.1(B) R429.2
Net-(Q183-3): Q183.3(C) R395.2 R428.1
Net-(Q184-1): Q184.1(B) R430.2 R431.2
Net-(Q184-3): Q184.3(C) R396.2 R429.1
Net-(Q185-1): Q185.1(B) R477.2 R478.2
Net-(Q185-3): Q185.3(C) R436.2 R462.1
Net-(Q186-1): Q186.1(B) R462.2
Net-(Q186-3): Q186.3(C) R437.2 R461.1
Net-(Q187-1): Q187.1(B) R461.2
Net-(Q187-3): Q187.3(C) R438.2 R458.1
Net-(Q188-1): Q188.1(B) R460.2
Net-(Q188-3): Q188.3(C) R439.2 R459.1
Net-(Q189-1): Q189.1(B) R458.2 R459.2
Net-(Q190-1): Q190.1(B) R463.2 R464.2
Net-(Q191-1): Q191.1(B) R465.2
Net-(Q191-3): Q191.3(C) R442.2 R463.1
Net-(Q192-1): Q192.1(B) R466.2
Net-(Q192-3): Q192.3(C) R443.2 R464.1
Net-(Q193-1): Q193.1(B) R479.2
Net-(Q194-1): Q194.1(B) R467.2
Net-(Q194-3): Q194.3(C) R444.2 R466.1
Net-(Q195-1): Q195.1(B) R473.2 R474.2
Net-(Q196-1): Q196.1(B) R475.2
Net-(Q196-3): Q196.3(C) R446.2 R473.1
Net-(Q197-1): Q197.1(B) R476.2
Net-(Q197-3): Q197.3(C) R447.2 R474.1
Net-(Q198-1): Q198.1(B) R468.2
Net-(Q199-1): Q199.1(B) R469.2 R470.2
Net-(Q199-3): Q199.3(C) R452.2 R468.1
Net-(Q200-1): Q200.1(B) R471.2 R472.2
Net-(Q201-1): Q201.1(B) R488.2
Net-(Q201-3): Q201.3(C) R454.2 R471.1
Net-(Q202-1): Q202.1(B) R489.2
Net-(Q202-3): Q202.3(C) R455.2 R472.1
Net-(Q203-1): Q203.1(B) R480.2 R481.2
Net-(Q204-1): Q204.1(B) R483.2
Net-(Q204-3): Q204.3(C) R434.2 R480.1
Net-(Q205-1): Q205.1(B) R482.2
Net-(Q205-3): Q205.3(C) R435.2 R481.1
Net-(Q206-1): Q206.1(B) R486.2 R487.2
Net-(Q207-1): Q207.1(B) R484.2
Net-(Q207-3): Q207.3(C) R449.2 R486.1
Net-(Q208-1): Q208.1(B) R485.2
Net-(Q208-3): Q208.3(C) R450.2 R487.1
Net-(Q209-1): Q209.1(B) R490.2
Net-(Q209-3): Q209.3(C) R456.2 R489.1
Net-(Q210-1): Q210.1(B) R491.2 R492.2
Net-(Q210-3): Q210.3(C) R457.2 R490.1
Net-(Q211-1): Q211.1(B) R493.2
Net-(Q211-3): Q211.3(C) R494.2 R497.1
Net-(Q212-1): Q212.1(B) R496.2
Net-(Q212-3): Q212.3(C) R495.2 R500.1
Net-(Q213-1): Q213.1(B) R497.2
Net-(Q214-1): Q214.1(B) R500.2

## Notes on the sheet
- .tran 0 5s 0 5s
